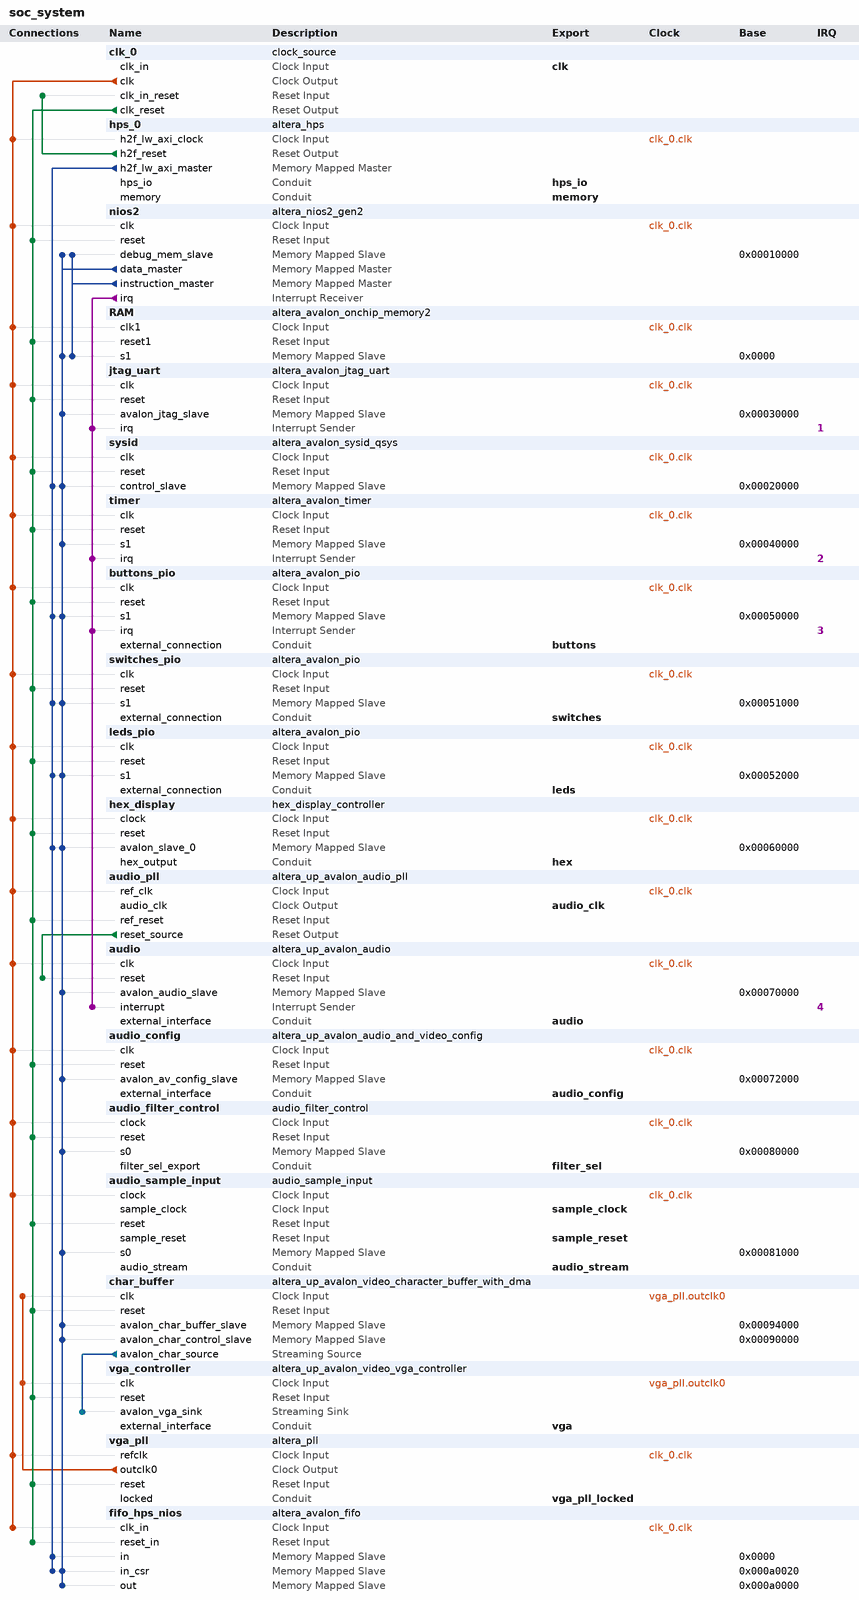
[diagram p0: system contents]
# Platform Designer (Qsys) system soc_system, Cyclone V 5CSEMA5F31C6
# Parameters at their usual value, and those the tool derives, are not listed.
package require -exact qsys 18.1
create_system soc_system
set_project_property DEVICE_FAMILY {Cyclone V}
set_project_property DEVICE 5CSEMA5F31C6

add_instance clk_0 clock_source 18.1
set_instance_parameter_value clk_0 clockFrequency 50000000

add_instance hps_0 altera_hps 18.1
set_instance_parameter_value hps_0 EMAC1_Mode RGMII
set_instance_parameter_value hps_0 EMAC1_PinMuxing {HPS I/O Set 0}
set_instance_parameter_value hps_0 F2SCLK_COLDRST_Enable false
set_instance_parameter_value hps_0 F2SCLK_DBGRST_Enable false
set_instance_parameter_value hps_0 F2SCLK_WARMRST_Enable false
set_instance_parameter_value hps_0 F2SINTERRUPT_Enable false
set_instance_parameter_value hps_0 F2S_Width 0
set_instance_parameter_value hps_0 FPGA_PERIPHERAL_OUTPUT_CLOCK_FREQ_EMAC0_GTX_CLK 125
set_instance_parameter_value hps_0 FPGA_PERIPHERAL_OUTPUT_CLOCK_FREQ_EMAC0_MD_CLK 2.5
set_instance_parameter_value hps_0 FPGA_PERIPHERAL_OUTPUT_CLOCK_FREQ_EMAC1_GTX_CLK 125
set_instance_parameter_value hps_0 FPGA_PERIPHERAL_OUTPUT_CLOCK_FREQ_EMAC1_MD_CLK 2.5
set_instance_parameter_value hps_0 HPS_PROTOCOL DDR3
set_instance_parameter_value hps_0 I2C0_Mode I2C
set_instance_parameter_value hps_0 I2C0_PinMuxing {HPS I/O Set 0}
set_instance_parameter_value hps_0 I2C1_Mode I2C
set_instance_parameter_value hps_0 I2C1_PinMuxing {HPS I/O Set 0}
set_instance_parameter_value hps_0 LWH2F_Enable true
set_instance_parameter_value hps_0 MEM_BANKADDR_WIDTH 3
set_instance_parameter_value hps_0 MEM_CLK_FREQ 400.0
set_instance_parameter_value hps_0 MEM_COL_ADDR_WIDTH 10
set_instance_parameter_value hps_0 MEM_DQ_WIDTH 32
set_instance_parameter_value hps_0 MEM_DRV_STR RZQ/6
set_instance_parameter_value hps_0 MEM_ROW_ADDR_WIDTH 15
set_instance_parameter_value hps_0 MEM_RTT_NOM RZQ/6
set_instance_parameter_value hps_0 MEM_RTT_WR {Dynamic ODT off}
set_instance_parameter_value hps_0 MEM_TCL 7
set_instance_parameter_value hps_0 MEM_TFAW_NS 45.0
set_instance_parameter_value hps_0 MEM_TRAS_NS 36.0
set_instance_parameter_value hps_0 MEM_TRCD_NS 13.125
set_instance_parameter_value hps_0 MEM_TRFC_NS 300.0
set_instance_parameter_value hps_0 MEM_TRP_NS 13.125
set_instance_parameter_value hps_0 MEM_VENDOR Micron
set_instance_parameter_value hps_0 MEM_WTCL 7
set_instance_parameter_value hps_0 QSPI_Mode N/A
set_instance_parameter_value hps_0 QSPI_PinMuxing Unused
set_instance_parameter_value hps_0 REF_CLK_FREQ 25.0
set_instance_parameter_value hps_0 S2FCLK_USER2CLK 5
set_instance_parameter_value hps_0 S2F_Width 0
set_instance_parameter_value hps_0 SDIO_Mode {4-bit Data}
set_instance_parameter_value hps_0 SDIO_PinMuxing {HPS I/O Set 0}
set_instance_parameter_value hps_0 SPIM1_Mode {Dual Slave Selects}
set_instance_parameter_value hps_0 SPIM1_PinMuxing {HPS I/O Set 0}
set_instance_parameter_value hps_0 STM_Enable false
set_instance_parameter_value hps_0 TIMING_BOARD_AC_SKEW 0.02
set_instance_parameter_value hps_0 TIMING_BOARD_AC_TO_CK_SKEW 0.01
set_instance_parameter_value hps_0 TIMING_BOARD_DQ_TO_DQS_SKEW 0.05
set_instance_parameter_value hps_0 TIMING_BOARD_MAX_CK_DELAY 0.03
set_instance_parameter_value hps_0 TIMING_BOARD_MAX_DQS_DELAY 0.02
set_instance_parameter_value hps_0 TIMING_BOARD_SKEW_BETWEEN_DQS 0.06
set_instance_parameter_value hps_0 TIMING_BOARD_SKEW_CKDQS_DIMM_MAX 0.12
set_instance_parameter_value hps_0 TIMING_BOARD_SKEW_CKDQS_DIMM_MIN 0.06
set_instance_parameter_value hps_0 TIMING_BOARD_SKEW_WITHIN_DQS 0.01
set_instance_parameter_value hps_0 TIMING_TDH 65
set_instance_parameter_value hps_0 TIMING_TDQSCK 255
set_instance_parameter_value hps_0 TIMING_TDQSQ 125
set_instance_parameter_value hps_0 TIMING_TDS 30
set_instance_parameter_value hps_0 TIMING_TIH 140
set_instance_parameter_value hps_0 TIMING_TIS 190
set_instance_parameter_value hps_0 TIMING_TQSH 0.4
set_instance_parameter_value hps_0 UART0_Mode {No Flow Control}
set_instance_parameter_value hps_0 UART0_PinMuxing {HPS I/O Set 0}
set_instance_parameter_value hps_0 USB1_Mode N/A
set_instance_parameter_value hps_0 USB1_PinMuxing Unused
set_instance_parameter_value hps_0 desired_cfg_clk_mhz 100.0
set_instance_parameter_value hps_0 desired_qspi_clk_mhz 400.0

add_instance nios2 altera_nios2_gen2 18.1
set_instance_parameter_value nios2 dcache_size 2048
set_instance_parameter_value nios2 exceptionSlave RAM.s1
set_instance_parameter_value nios2 icache_size 4096
set_instance_parameter_value nios2 impl Tiny
set_instance_parameter_value nios2 resetSlave RAM.s1

add_instance RAM altera_avalon_onchip_memory2 18.1
set_instance_parameter_value RAM dataWidth 32
set_instance_parameter_value RAM dualPort false
set_instance_parameter_value RAM initMemContent true
set_instance_parameter_value RAM initializationFileName onchip_mem.hex
set_instance_parameter_value RAM memorySize 65536

add_instance jtag_uart altera_avalon_jtag_uart 18.1
set_instance_parameter_value jtag_uart simInteractiveOptions NO_INTERACTIVE_WINDOWS

add_instance sysid altera_avalon_sysid_qsys 18.1
set_instance_parameter_value sysid id -2147374262

add_instance timer altera_avalon_timer 18.1
set_instance_parameter_value timer period 1
set_instance_parameter_value timer periodUnits MSEC

add_instance buttons_pio altera_avalon_pio 18.1
set_instance_parameter_value buttons_pio bitClearingEdgeCapReg true
set_instance_parameter_value buttons_pio captureEdge true
set_instance_parameter_value buttons_pio direction Input
set_instance_parameter_value buttons_pio edgeType FALLING
set_instance_parameter_value buttons_pio generateIRQ true
set_instance_parameter_value buttons_pio irqType EDGE
set_instance_parameter_value buttons_pio width 4

add_instance switches_pio altera_avalon_pio 18.1
set_instance_parameter_value switches_pio direction Input
set_instance_parameter_value switches_pio width 10

add_instance leds_pio altera_avalon_pio 18.1
set_instance_parameter_value leds_pio direction Output
set_instance_parameter_value leds_pio width 10

add_instance hex_display hex_display_controller 1.0

add_instance audio_pll altera_up_avalon_audio_pll 18.0
set_instance_parameter_value audio_pll audio_clk_freq 11.2896
set_instance_parameter_value audio_pll gui_refclk 50.0

add_instance audio altera_up_avalon_audio 18.0
set_instance_parameter_value audio audio_in false
set_instance_parameter_value audio avalon_bus_type {Memory Mapped}
set_instance_parameter_value audio dw 16

add_instance audio_config altera_up_avalon_audio_and_video_config 18.0
set_instance_parameter_value audio_config audio_in {Microphone to ADC}
set_instance_parameter_value audio_config bit_length 16
set_instance_parameter_value audio_config board DE1-SoC
set_instance_parameter_value audio_config data_format {I2S Format}
set_instance_parameter_value audio_config line_in_bypass false
set_instance_parameter_value audio_config sampling_rate {48 kHz}

add_instance audio_filter_control audio_filter_control 1.0

add_instance audio_sample_input audio_sample_input 1.0
set_instance_parameter_value audio_sample_input FIFO_ADDR_WIDTH 10
set_instance_parameter_value audio_sample_input FIFO_DEPTH 1024

add_instance char_buffer altera_up_avalon_video_character_buffer_with_dma 18.0
set_instance_parameter_value char_buffer enable_transparency false

add_instance vga_controller altera_up_avalon_video_vga_controller 18.0
set_instance_parameter_value vga_controller board DE1-SoC
set_instance_parameter_value vga_controller resolution {VGA 640x480}

add_instance vga_pll altera_pll 18.1
set_instance_parameter_value vga_pll gui_device_speed_grade 1
set_instance_parameter_value vga_pll gui_number_of_clocks 1
set_instance_parameter_value vga_pll gui_operation_mode direct
set_instance_parameter_value vga_pll gui_output_clock_frequency0 25.0
set_instance_parameter_value vga_pll gui_pll_mode {Integer-N PLL}
set_instance_parameter_value vga_pll gui_reference_clock_frequency 50.0
set_instance_parameter_value vga_pll gui_use_locked true

add_instance fifo_hps_nios altera_avalon_fifo 18.1
set_instance_parameter_value fifo_hps_nios bitsPerSymbol 16
set_instance_parameter_value fifo_hps_nios channelWidth 8
set_instance_parameter_value fifo_hps_nios errorWidth 8
set_instance_parameter_value fifo_hps_nios fifoDepth 1024
set_instance_parameter_value fifo_hps_nios fifoInputInterfaceOptions AVALONMM_WRITE
set_instance_parameter_value fifo_hps_nios fifoOutputInterfaceOptions AVALONMM_READ
set_instance_parameter_value fifo_hps_nios singleClockMode true
set_instance_parameter_value fifo_hps_nios symbolsPerBeat 2
set_instance_parameter_value fifo_hps_nios useIRQ true
set_instance_parameter_value fifo_hps_nios usePacket true
set_instance_parameter_value fifo_hps_nios useReadControl false

# connections
add_connection clk_0.clk audio.clk clock
add_connection clk_0.clk audio_config.clk clock
add_connection clk_0.clk audio_filter_control.clock clock
add_connection clk_0.clk audio_pll.ref_clk clock
add_connection clk_0.clk audio_sample_input.clock clock
add_connection clk_0.clk buttons_pio.clk clock
add_connection clk_0.clk fifo_hps_nios.clk_in clock
add_connection clk_0.clk hex_display.clock clock
add_connection clk_0.clk hps_0.h2f_lw_axi_clock clock
add_connection clk_0.clk jtag_uart.clk clock
add_connection clk_0.clk leds_pio.clk clock
add_connection clk_0.clk nios2.clk clock
add_connection clk_0.clk RAM.clk1 clock
add_connection clk_0.clk switches_pio.clk clock
add_connection clk_0.clk sysid.clk clock
add_connection clk_0.clk timer.clk clock
add_connection clk_0.clk vga_pll.refclk clock
add_connection vga_pll.outclk0 char_buffer.clk clock
add_connection vga_pll.outclk0 vga_controller.clk clock
add_connection audio_pll.reset_source audio.reset reset
add_connection clk_0.clk_reset audio_config.reset reset
add_connection clk_0.clk_reset audio_filter_control.reset reset
add_connection clk_0.clk_reset audio_pll.ref_reset reset
add_connection clk_0.clk_reset audio_sample_input.reset reset
add_connection clk_0.clk_reset buttons_pio.reset reset
add_connection clk_0.clk_reset char_buffer.reset reset
add_connection clk_0.clk_reset fifo_hps_nios.reset_in reset
add_connection clk_0.clk_reset hex_display.reset reset
add_connection clk_0.clk_reset jtag_uart.reset reset
add_connection clk_0.clk_reset leds_pio.reset reset
add_connection clk_0.clk_reset nios2.reset reset
add_connection clk_0.clk_reset RAM.reset1 reset
add_connection clk_0.clk_reset switches_pio.reset reset
add_connection clk_0.clk_reset sysid.reset reset
add_connection clk_0.clk_reset timer.reset reset
add_connection clk_0.clk_reset vga_controller.reset reset
add_connection clk_0.clk_reset vga_pll.reset reset
add_connection hps_0.h2f_reset clk_0.clk_in_reset reset
add_connection hps_0.h2f_lw_axi_master buttons_pio.s1 avalon
set_connection_parameter_value hps_0.h2f_lw_axi_master/buttons_pio.s1 baseAddress 0x00050000
add_connection hps_0.h2f_lw_axi_master fifo_hps_nios.in avalon
set_connection_parameter_value hps_0.h2f_lw_axi_master/fifo_hps_nios.in baseAddress 0x0000
add_connection hps_0.h2f_lw_axi_master fifo_hps_nios.in_csr avalon
set_connection_parameter_value hps_0.h2f_lw_axi_master/fifo_hps_nios.in_csr baseAddress 0x000a0020
add_connection hps_0.h2f_lw_axi_master hex_display.avalon_slave_0 avalon
set_connection_parameter_value hps_0.h2f_lw_axi_master/hex_display.avalon_slave_0 baseAddress 0x00060000
add_connection hps_0.h2f_lw_axi_master leds_pio.s1 avalon
set_connection_parameter_value hps_0.h2f_lw_axi_master/leds_pio.s1 baseAddress 0x00052000
add_connection hps_0.h2f_lw_axi_master switches_pio.s1 avalon
set_connection_parameter_value hps_0.h2f_lw_axi_master/switches_pio.s1 baseAddress 0x00051000
add_connection hps_0.h2f_lw_axi_master sysid.control_slave avalon
set_connection_parameter_value hps_0.h2f_lw_axi_master/sysid.control_slave baseAddress 0x00020000
add_connection nios2.data_master audio.avalon_audio_slave avalon
set_connection_parameter_value nios2.data_master/audio.avalon_audio_slave baseAddress 0x00070000
add_connection nios2.data_master audio_config.avalon_av_config_slave avalon
set_connection_parameter_value nios2.data_master/audio_config.avalon_av_config_slave baseAddress 0x00072000
add_connection nios2.data_master audio_filter_control.s0 avalon
set_connection_parameter_value nios2.data_master/audio_filter_control.s0 baseAddress 0x00080000
add_connection nios2.data_master audio_sample_input.s0 avalon
set_connection_parameter_value nios2.data_master/audio_sample_input.s0 baseAddress 0x00081000
add_connection nios2.data_master buttons_pio.s1 avalon
set_connection_parameter_value nios2.data_master/buttons_pio.s1 baseAddress 0x00050000
add_connection nios2.data_master char_buffer.avalon_char_buffer_slave avalon
set_connection_parameter_value nios2.data_master/char_buffer.avalon_char_buffer_slave baseAddress 0x00094000
add_connection nios2.data_master char_buffer.avalon_char_control_slave avalon
set_connection_parameter_value nios2.data_master/char_buffer.avalon_char_control_slave baseAddress 0x00090000
add_connection nios2.data_master fifo_hps_nios.in_csr avalon
set_connection_parameter_value nios2.data_master/fifo_hps_nios.in_csr baseAddress 0x000a0020
add_connection nios2.data_master fifo_hps_nios.out avalon
set_connection_parameter_value nios2.data_master/fifo_hps_nios.out baseAddress 0x000a0000
add_connection nios2.data_master hex_display.avalon_slave_0 avalon
set_connection_parameter_value nios2.data_master/hex_display.avalon_slave_0 baseAddress 0x00060000
add_connection nios2.data_master jtag_uart.avalon_jtag_slave avalon
set_connection_parameter_value nios2.data_master/jtag_uart.avalon_jtag_slave baseAddress 0x00030000
add_connection nios2.data_master leds_pio.s1 avalon
set_connection_parameter_value nios2.data_master/leds_pio.s1 baseAddress 0x00052000
add_connection nios2.data_master nios2.debug_mem_slave avalon
set_connection_parameter_value nios2.data_master/nios2.debug_mem_slave baseAddress 0x00010000
add_connection nios2.data_master RAM.s1 avalon
set_connection_parameter_value nios2.data_master/RAM.s1 baseAddress 0x0000
add_connection nios2.data_master switches_pio.s1 avalon
set_connection_parameter_value nios2.data_master/switches_pio.s1 baseAddress 0x00051000
add_connection nios2.data_master sysid.control_slave avalon
set_connection_parameter_value nios2.data_master/sysid.control_slave baseAddress 0x00020000
add_connection nios2.data_master timer.s1 avalon
set_connection_parameter_value nios2.data_master/timer.s1 baseAddress 0x00040000
add_connection nios2.instruction_master nios2.debug_mem_slave avalon
set_connection_parameter_value nios2.instruction_master/nios2.debug_mem_slave baseAddress 0x00010000
add_connection nios2.instruction_master RAM.s1 avalon
set_connection_parameter_value nios2.instruction_master/RAM.s1 baseAddress 0x0000
add_connection char_buffer.avalon_char_source vga_controller.avalon_vga_sink avalon_streaming
add_connection nios2.irq audio.interrupt interrupt
set_connection_parameter_value nios2.irq/audio.interrupt irqNumber 4
add_connection nios2.irq buttons_pio.irq interrupt
set_connection_parameter_value nios2.irq/buttons_pio.irq irqNumber 3
add_connection nios2.irq jtag_uart.irq interrupt
set_connection_parameter_value nios2.irq/jtag_uart.irq irqNumber 1
add_connection nios2.irq timer.irq interrupt
set_connection_parameter_value nios2.irq/timer.irq irqNumber 2

# exported interfaces
add_interface audio conduit end
set_interface_property audio EXPORT_OF audio.external_interface
add_interface audio_clk clock source
set_interface_property audio_clk EXPORT_OF audio_pll.audio_clk
add_interface audio_config conduit end
set_interface_property audio_config EXPORT_OF audio_config.external_interface
add_interface audio_stream conduit end
set_interface_property audio_stream EXPORT_OF audio_sample_input.audio_stream
add_interface buttons conduit end
set_interface_property buttons EXPORT_OF buttons_pio.external_connection
add_interface clk clock sink
set_interface_property clk EXPORT_OF clk_0.clk_in
add_interface filter_sel conduit end
set_interface_property filter_sel EXPORT_OF audio_filter_control.filter_sel_export
add_interface hex conduit end
set_interface_property hex EXPORT_OF hex_display.hex_output
add_interface hps_io conduit end
set_interface_property hps_io EXPORT_OF hps_0.hps_io
add_interface leds conduit end
set_interface_property leds EXPORT_OF leds_pio.external_connection
add_interface memory conduit end
set_interface_property memory EXPORT_OF hps_0.memory
add_interface sample_clock clock sink
set_interface_property sample_clock EXPORT_OF audio_sample_input.sample_clock
add_interface sample_reset reset sink
set_interface_property sample_reset EXPORT_OF audio_sample_input.sample_reset
add_interface switches conduit end
set_interface_property switches EXPORT_OF switches_pio.external_connection
add_interface vga conduit end
set_interface_property vga EXPORT_OF vga_controller.external_interface
add_interface vga_pll_locked conduit end
set_interface_property vga_pll_locked EXPORT_OF vga_pll.locked

set_interconnect_requirement {$system} qsys_mm.clockCrossingAdapter HANDSHAKE
set_interconnect_requirement {$system} qsys_mm.enableEccProtection FALSE
set_interconnect_requirement {$system} qsys_mm.insertDefaultSlave FALSE
set_interconnect_requirement {$system} qsys_mm.maxAdditionalLatency 1

save_system soc_system.qsys
